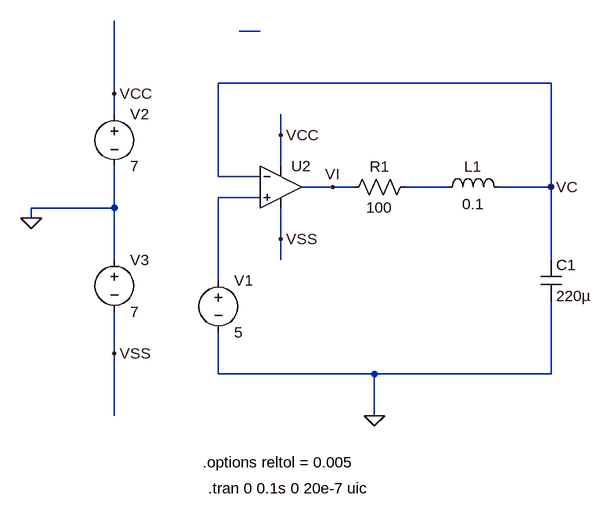
[diagram p0: schematic practica_2.asc]
practica_2.asc, the LTspice schematic file:
Version 4
SHEET 1 880 680
WIRE 48 -208 16 -208
WIRE 496 -128 -16 -128
WIRE -176 -112 -176 -224
WIRE -176 -80 -176 -112
WIRE 80 -48 80 -80
WIRE 80 0 80 -48
WIRE -16 16 -16 -128
WIRE 48 16 -16 16
WIRE 160 32 112 32
WIRE 192 32 160 32
WIRE 336 32 272 32
WIRE 496 32 496 -128
WIRE 496 32 416 32
WIRE 48 48 -16 48
WIRE -176 64 -176 0
WIRE -176 64 -304 64
WIRE -304 80 -304 64
WIRE 80 112 80 64
WIRE -176 144 -176 64
WIRE 80 144 80 112
WIRE 496 144 496 32
WIRE -16 176 -16 48
WIRE -176 288 -176 224
WIRE -16 320 -16 256
WIRE 224 320 -16 320
WIRE 496 320 496 208
WIRE 496 320 224 320
WIRE -176 384 -176 288
WIRE 224 384 224 320
FLAG 496 32 VC
FLAG -304 80 0
FLAG -176 -112 VCC
FLAG -176 288 VSS
FLAG 224 384 0
FLAG 80 -48 VCC
FLAG 80 112 VSS
FLAG 160 32 VI
SYMBOL voltage -16 160 R0
WINDOW 123 0 0 Left 0
WINDOW 39 0 0 Left 0
SYMATTR InstName V1
SYMATTR Value 5
SYMBOL ind 320 48 R270
WINDOW 0 32 56 VTop 2
WINDOW 3 5 56 VBottom 2
SYMATTR InstName L1
SYMATTR Value 0.1
SYMBOL cap 480 144 R0
SYMATTR InstName C1
SYMATTR Value 220µ
SYMBOL voltage -176 -96 R0
WINDOW 123 0 0 Left 0
WINDOW 39 0 0 Left 0
SYMATTR InstName V2
SYMATTR Value 7
SYMBOL voltage -176 128 R0
WINDOW 123 0 0 Left 0
WINDOW 39 0 0 Left 0
SYMATTR InstName V3
SYMATTR Value 7
SYMBOL OpAmps\\UniversalOpAmp2 80 32 R0
SYMATTR InstName U2
SYMBOL res 288 16 R90
WINDOW 0 0 56 VBottom 2
WINDOW 3 32 56 VTop 2
SYMATTR InstName R1
SYMATTR Value 100
TEXT -40 456 Left 2 !.options reltol = 0.005
TEXT -32 496 Left 2 !.tran 0 0.1s 0 20e-7 uic

The netlist it stands for:
* practica_2.asc
V1 N003 0 5
L1 N002 VC 0.1
C1 VC 0 220µ
V2 VCC 0 7
V3 0 VSS 7
XU2 N003 VC VCC VSS VI level2 Avol=1Meg GBW=10Meg Slew=10Meg Ilimit=25m Rail=0 Vos=0 En=0 Enk=0 In=0 Ink=0 Rin=500Meg  ; pins In+ In- V+ V- OUT
R1 N002 VI 100
.options reltol = 0.005
.tran 0 0.1s 0 20e-7 uic
.lib UniversalOpAmp2.lib
.backanno
.end